# Altium project Audio_Mini.PrjPcb (part 1 of 2)
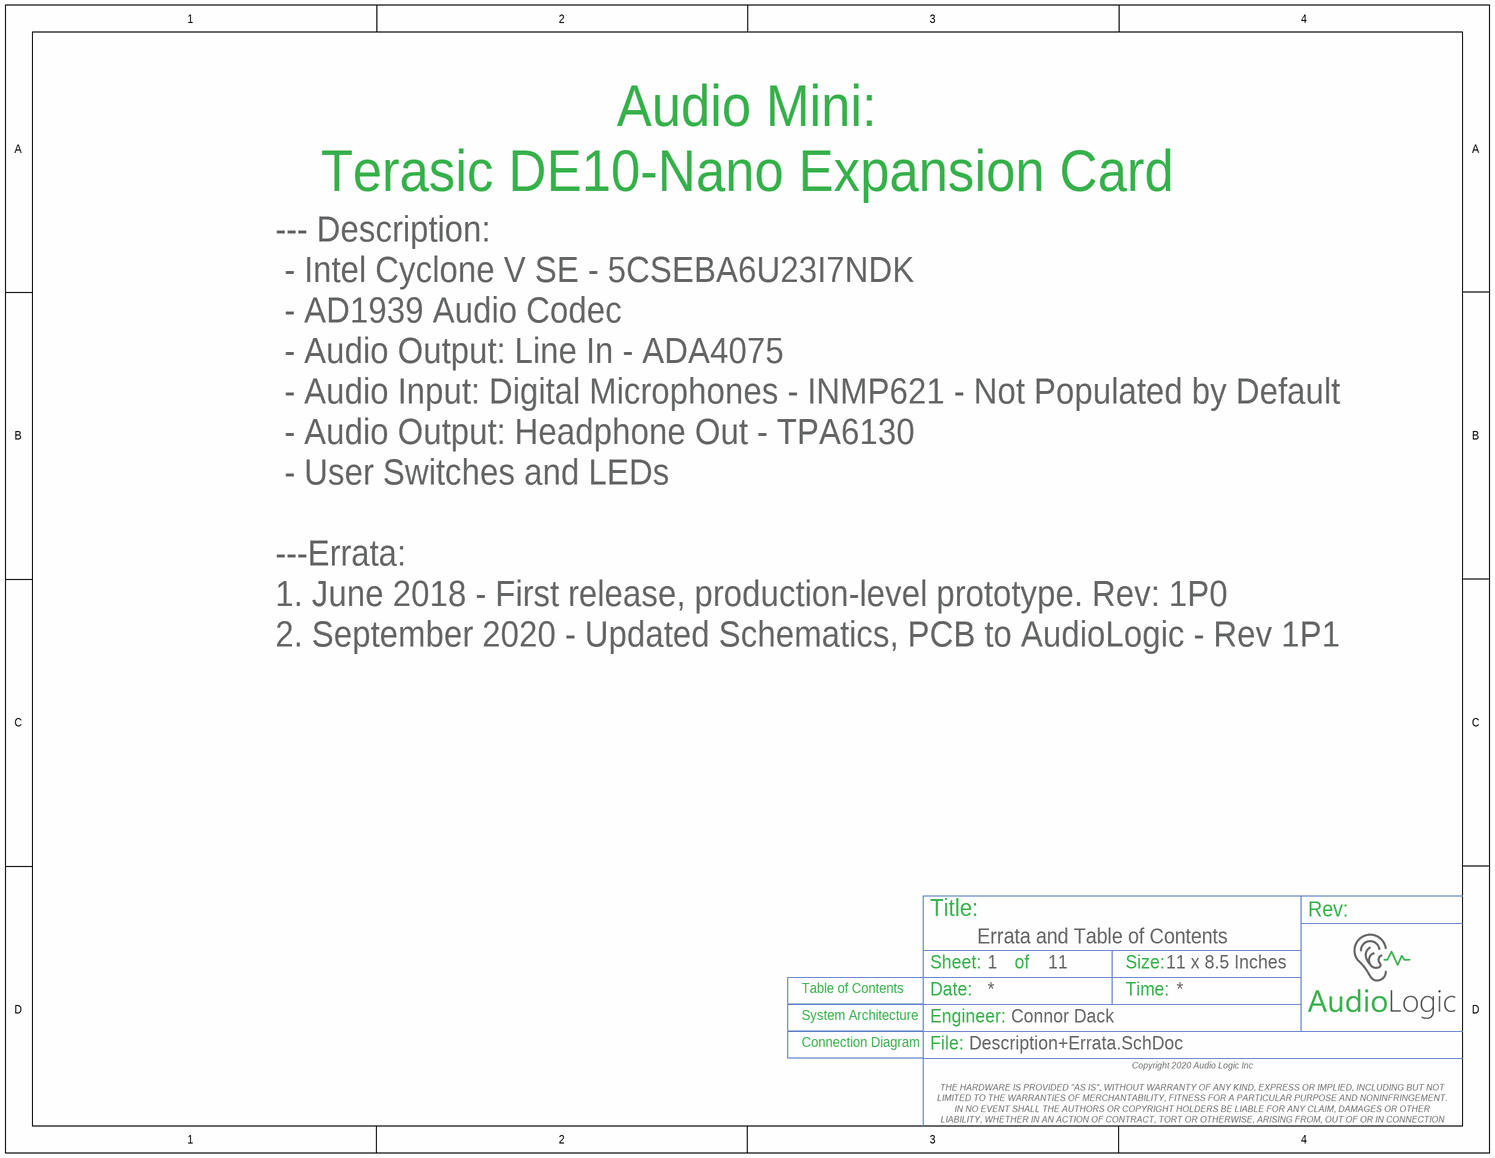
[diagram p0: Description+Errata.SchDoc]
PCB_Name: Audio_Mini_Bare_PCB; PCB_Revision: 1.0
8 sheets, 129 parts. Net scope: flat (ports and power ports of the same name join across sheets).
Board file: Audio_Mini.PcbDoc
Sheets:
  Description+Errata.SchDoc
    System Architecture = System_Architecture.SchDoc
  Audio_Codec.SchDoc
  FPGA_Connectors.SchDoc
  Power.SchDoc
  Support.SchDoc
  Audio_Input_Line_In.SchDoc
  Audio_Output_Headphone.SchDoc

## Sheet Description+Errata.SchDoc: Errata and Table of Contents
size 279 x 215 mm; DrawnBy: Connor Dack; Engineer: Connor Dack; DocumentNumber: 1; Revision: 1.0; SheetNumber: 1; SheetTotal: 11

### Sub-sheets
Connection Diagram = TopLevel.SchDoc (file not in this document): no entries
System Architecture = System_Architecture.SchDoc: no entries
Table of Contents = ToC.SchDoc (file not in this document): no entries

### Notes on the sheet
- Audio Mini:
  Terasic DE10-Nano Expansion Card
- --- Description:
  - Intel Cyclone V SE - 5CSEBA6U23I7NDK
  - AD1939 Audio Codec
  - Audio Output: Line In - ADA4075
  - Audio Input: Digital Microphones - INMP621 - Not Populated by Default
  - Audio Output: Headphone Out - TPA6130
  - User Switches and LEDs
  ---Errata:
  1. June 2018 - First release, production-level prototype. Rev: 1P0
  2. September 2020 - Updated Schematics, PCB to AudioLogic - Rev 1P1
- Title:
- Sheet:
- of
- Size:
- 11 x 8.5 Inches
- Rev:
- Date:
- Engineer:
- Time:
- File:
- Copyright 2020 Audio Logic Inc
  THE HARDWARE IS PROVIDED "AS IS", WITHOUT WARRANTY OF ANY KIND, EXPRESS OR IMPLIED, INCLUDING BUT NOT LIMITED TO THE WARRANTIES OF MERCHANTABILITY, FITNESS FOR A PARTICULAR PURPOSE AND NONINFRINGEMENT. IN NO EVENT SHALL THE AUTHORS OR COPYRIGHT HOLDERS BE LIABLE FOR ANY CLAIM, DAMAGES OR OTHER LIABILITY, WHETHER IN AN ACTION OF CONTRACT, TORT OR OTHERWISE, ARISING FROM, OUT OF OR IN CONNECTION WITH THE HARDWARE OR THE USE OR OTHER DEALINGS IN THE HARDWARE.

## Sheet System_Architecture.SchDoc: System Architecture
size 279 x 215 mm; CompanyName: Flat Earth Inc.; DrawnBy: Connor Dack; Engineer: Connor Dack; Address1: 985 Technology Blvd; Address2: Suite 102; Address3: Bozeman, MT, 59718; DocumentNumber: 3; Revision: 0.0; SheetNumber: 3; SheetTotal: 11
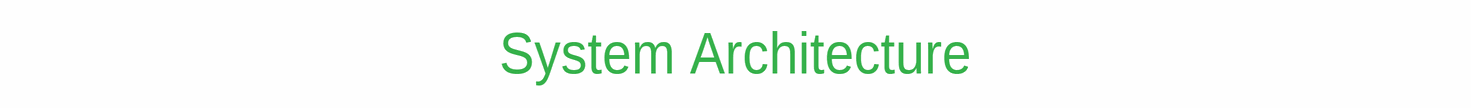
[diagram p1: System_Architecture.SchDoc]

### Notes on the sheet
- System Architecture
- Title:
- Sheet:
- of
- Size:
- 11 x 8.5 Inches
- Rev:
- Date:
- Engineer:
- Time:
- File:
- Copyright 2020 Audio Logic Inc
  THE HARDWARE IS PROVIDED "AS IS", WITHOUT WARRANTY OF ANY KIND, EXPRESS OR IMPLIED, INCLUDING BUT NOT LIMITED TO THE WARRANTIES OF MERCHANTABILITY, FITNESS FOR A PARTICULAR PURPOSE AND NONINFRINGEMENT. IN NO EVENT SHALL THE AUTHORS OR COPYRIGHT HOLDERS BE LIABLE FOR ANY CLAIM, DAMAGES OR OTHER LIABILITY, WHETHER IN AN ACTION OF CONTRACT, TORT OR OTHERWISE, ARISING FROM, OUT OF OR IN CONNECTION WITH THE HARDWARE OR THE USE OR OTHER DEALINGS IN THE HARDWARE.

## Sheet Audio_Codec.SchDoc: Audio Codec
size 279 x 215 mm; DrawnBy: Connor Dack; Engineer: Connor Dack; DocumentNumber: 5; Revision: 1.0; SheetNumber: 5; SheetTotal: 11
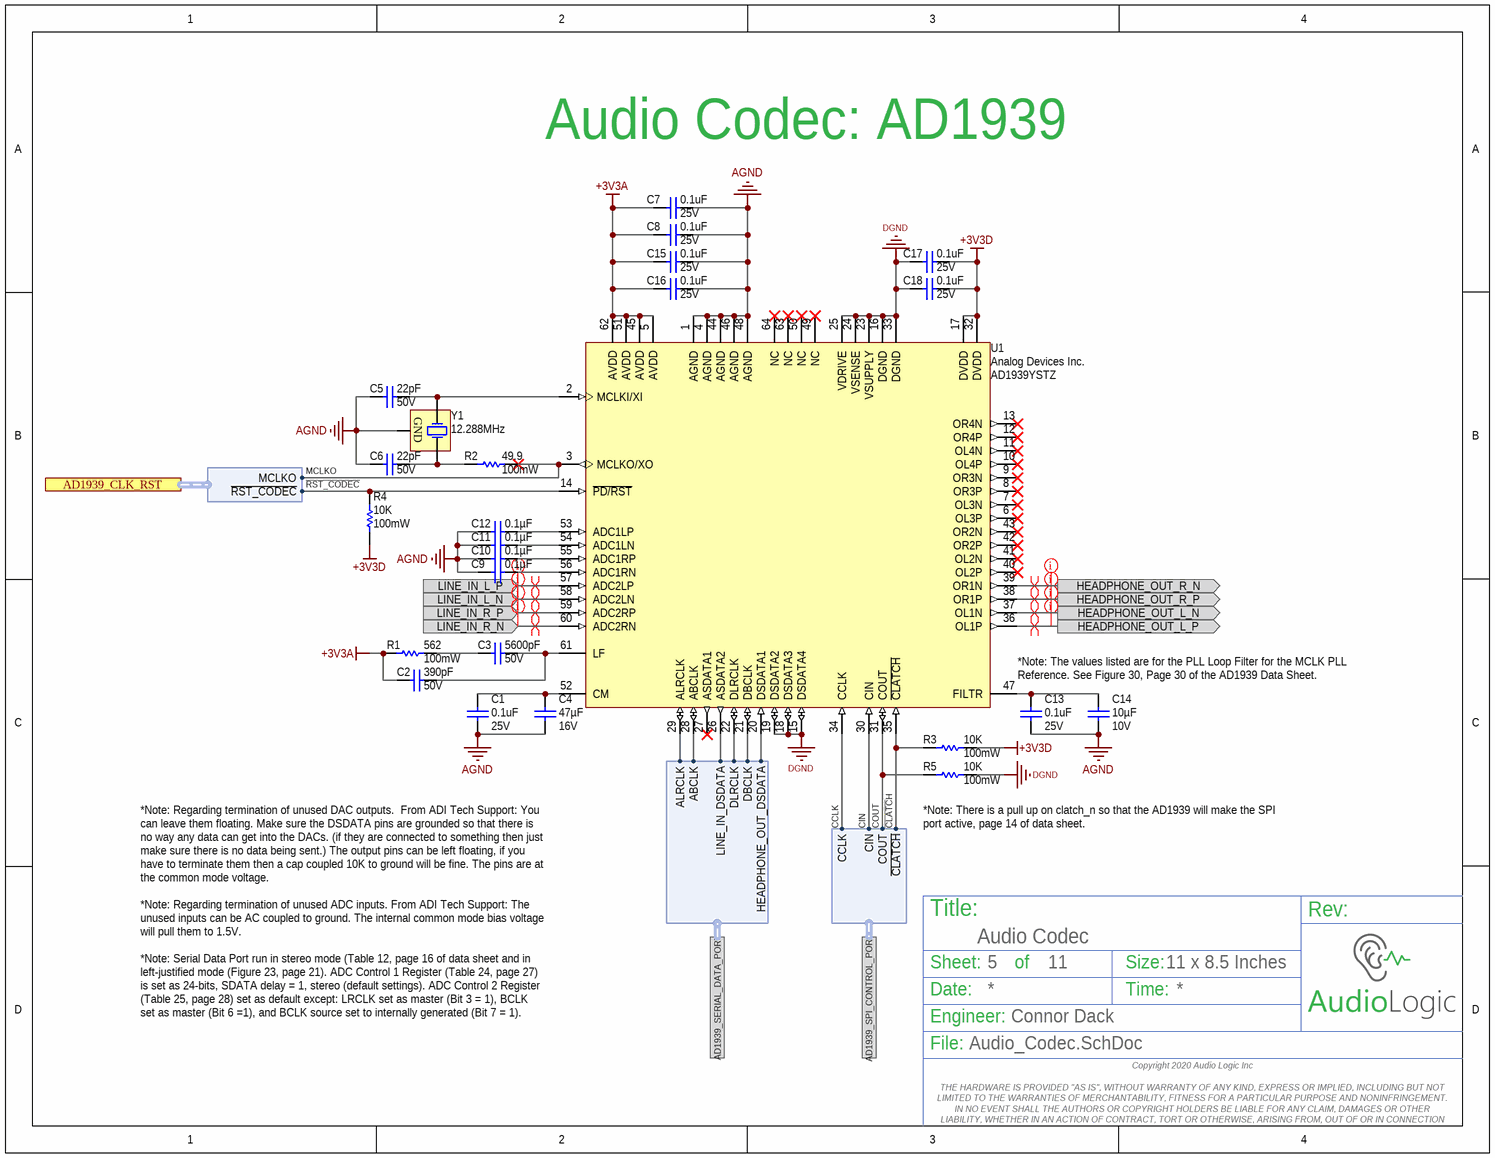
[diagram p2: Audio_Codec.SchDoc]

### Parts
C1  Voltage Rating: 25V  Capacitance: 0.1uF  [3-0603_L]  (hidden comment: CGA3E2X7R1E104K080AA)
C2  Voltage - Rated: 50V  Capacitance: 390pF  [3-0603_L]  (hidden comment: CL10B391KB8NNNC)
C3  Voltage - Rated: 50V  Capacitance: 5600pF  [3-0603_L]  (hidden comment: CL10B562KB8SFNC)
C4  Voltage - Rated: 16V  Capacitance: 47µF  [C1210X25_L]  (hidden comment: GRM32EC81C476KE15L)
C5  Voltage Rating: 50V  Capacitance: 22pF  [3-0603_L]  (hidden comment: CGA3E2C0G1H220J080AA)
C6  Voltage Rating: 50V  Capacitance: 22pF  [3-0603_L]  (hidden comment: CGA3E2C0G1H220J080AA)
C7  Voltage Rating: 25V  Capacitance: 0.1uF  [3-0603_L]  (hidden comment: CGA3E2X7R1E104K080AA)
C8  Voltage Rating: 25V  Capacitance: 0.1uF  [3-0603_L]  (hidden comment: CGA3E2X7R1E104K080AA)
C9  Capacitance: 0.1µF  [2-0402_L]  (hidden comment: CGA2B3X7R1H104K050BB)
C10  Capacitance: 0.1µF  [2-0402_L]  (hidden comment: CGA2B3X7R1H104K050BB)
C11  Capacitance: 0.1µF  [2-0402_L]  (hidden comment: CGA2B3X7R1H104K050BB)
C12  Capacitance: 0.1µF  [2-0402_L]  (hidden comment: CGA2B3X7R1H104K050BB)
C13  Voltage Rating: 25V  Capacitance: 0.1uF  [3-0603_L]  (hidden comment: CGA3E2X7R1E104K080AA)
C14  Voltage - Rated: 10V  Capacitance: 10µF  [3-0603_L]  (hidden comment: C1608X5R1A106K)
C15  Voltage Rating: 25V  Capacitance: 0.1uF  [3-0603_L]  (hidden comment: CGA3E2X7R1E104K080AA)
C16  Voltage Rating: 25V  Capacitance: 0.1uF  [3-0603_L]  (hidden comment: CGA3E2X7R1E104K080AA)
C17  Voltage Rating: 25V  Capacitance: 0.1uF  [3-0603_L]  (hidden comment: CGA3E2X7R1E104K080AA)
C18  Voltage Rating: 25V  Capacitance: 0.1uF  [3-0603_L]  (hidden comment: CGA3E2X7R1E104K080AA)
R1  Power (Watts): 100mW  Resistance (Ohms): 562  [3-0603_R_L]  (hidden comment: ERJ-3EKF5620V)
R2  Power (Watts): 100mW  Resistance (Ohms): 49.9  [3-0603_R_L]  (hidden comment: ERJ-3EKF49R9V)
R3  Power (Watts): 100mW  Resistance (Ohms): 10K  [3-0603_R_L]  (hidden comment: ERJ-3GEYJ103V)
R4  Power (Watts): 100mW  Resistance (Ohms): 10K  [3-0603_R_L]  (hidden comment: ERJ-3GEYJ103V)
R5  Power (Watts): 100mW  Resistance (Ohms): 10K  [3-0603_R_L]  (hidden comment: ERJ-3GEYJ103V)
U1  AD1939YSTZ  Manufacturer: Analog Devices Inc.  [ST_64_2]
Y1  Frequency: 12.288MHz  [ADM3B]  (hidden comment: ABM3B-12.288MHZ-10-1-U-T)

### Ports
AD1939_CLK_RST (harness AD1939_CLK_RST), AD1939_SERIAL_DATA_PORT (harness AD19319_Serial_Data_Port), AD1939_SPI_CONTROL_PORT (harness SPI_Audio_Codec), HEADPHONE_OUT_L_N (out), HEADPHONE_OUT_L_P (out), HEADPHONE_OUT_R_N (out), HEADPHONE_OUT_R_P (out), LINE_IN_L_N (in), LINE_IN_L_P (in), LINE_IN_R_N (in), LINE_IN_R_P (in)

### Harnesses
SPI_Audio_Codec: CIN, COUT, CCLK, ~{CLATCH}
AD19319_Serial_Data_Port: ABCLK, ALRCLK, LINE_IN_DSDATA, DLRCLK, DBCLK, HEADPHONE_OUT_DSDATA
AD1939_CLK_RST: ~{RST_CODEC}, MCLKO

### Nets
+3V3A: C2.1 C7.1 C8.2 C15.1 C16.1 R1.1 U1.5(AVDD) U1.45(AVDD) U1.51(AVDD) U1.62(AVDD)
+3V3D: C17.2 C18.1 R3.1 R4.1 U1.17(DVDD) U1.32(DVDD)
AGND: C1.1 C4.2 C5.1 C6.1 C7.2 C8.1 C9.2 C10.2 C11.2 C12.2 C13.1 C14.1 C15.2 C16.2 C17.1 C18.2 R5.1 U1.1(AGND) U1.4(AGND) U1.15(DSDATA4) U1.16(DGND) U1.18(DSDATA3) U1.19(DSDATA2) U1.23(VSUPPLY) U1.24(VSENSE) U1.25(VDRIVE) U1.33(DGND) U1.44(AGND) U1.46(AGND) U1.48(AGND) Y1.2(GND)  [also labelled DGND]
~{CLATC}H: R3.2 U1.35(~{CLATCH}) ; port AD1939_SPI_CONTROL_PORT.~{CLATCH}
ABCLK: U1.28(ABCLK) ; port AD1939_SERIAL_DATA_PORT.ABCLK
ALRCLK: U1.29(ALRCLK) ; port AD1939_SERIAL_DATA_PORT.ALRCLK
CCLK: U1.34(CCLK) ; port AD1939_SPI_CONTROL_PORT.CCLK
CIN: U1.30(CIN) ; port AD1939_SPI_CONTROL_PORT.CIN
COUT: R5.2 U1.31(COUT) ; port AD1939_SPI_CONTROL_PORT.COUT
DBCLK: U1.21(DBCLK) ; port AD1939_SERIAL_DATA_PORT.DBCLK
DLRCLK: U1.22(DLRCLK) ; port AD1939_SERIAL_DATA_PORT.DLRCLK
HEADPHONE_OUT_DSDATA: U1.20(DSDATA1) ; port AD1939_SERIAL_DATA_PORT.HEADPHONE_OUT_DSDATA
HEADPHONE_OUT_L_N: U1.37(OL1N) ; port HEADPHONE_OUT_L_N
HEADPHONE_OUT_L_P: U1.36(OL1P) ; port HEADPHONE_OUT_L_P
HEADPHONE_OUT_R_N: U1.39(OR1N) ; port HEADPHONE_OUT_R_N
HEADPHONE_OUT_R_P: U1.38(OR1P) ; port HEADPHONE_OUT_R_P
LINE_IN_DSDATA: U1.26(ASDATA2) ; port AD1939_SERIAL_DATA_PORT.LINE_IN_DSDATA
LINE_IN_L_N: U1.58(ADC2LN) ; port LINE_IN_L_N
LINE_IN_L_P: U1.57(ADC2LP) ; port LINE_IN_L_P
LINE_IN_R_N: U1.60(ADC2RN) ; port LINE_IN_R_N
LINE_IN_R_P: U1.59(ADC2RP) ; port LINE_IN_R_P
MCLKO: R2.2 U1.3(MCLKO/XO) ; port AD1939_CLK_RST.MCLKO
~{RST_CODEC}: R4.2 U1.14(~{PD/RST}) ; port AD1939_CLK_RST.~{RST_CODEC}
NetC1_2: C1.2 C4.1 U1.52(CM)
NetC2_2: C2.2 C3.2 U1.61(LF)
NetC3_1: C3.1 R1.2
NetC5_2: C5.2 U1.2(MCLKI/XI) Y1.1(OSC1)
NetC6_2: C6.2 R2.1 Y1.3(OSC2)
NetC9_1: C9.1 U1.56(ADC1RN)
NetC10_1: C10.1 U1.55(ADC1RP)
NetC11_1: C11.1 U1.54(ADC1LN)
NetC12_1: C12.1 U1.53(ADC1LP)
NetC13_2: C13.2 C14.2 U1.47(FILTR)

Not connected (* = marked no-connect by the designer): U1 6(OL3P)* 7(OL3N)* 8(OR3P)* 9(OR3N)* 10(OL4P)* 11(OL4N)* 12(OR4P)* 13(OR4N)* 27(ASDATA1)* 40(OL2P)* 41(OL2N)* 42(OR2P)* 43(OR2N)* 49(NC)* 50(NC)* 63(NC)* 64(NC)*

### Layout directives
differential pair: HEADPHONE_OUT_L_N, HEADPHONE_OUT_L_P, HEADPHONE_OUT_R_N, HEADPHONE_OUT_R_P, LINE_IN_L_N, LINE_IN_L_P, LINE_IN_R_N, LINE_IN_R_P
net class Headphone: HEADPHONE_OUT_L_N, HEADPHONE_OUT_L_P, HEADPHONE_OUT_R_N, HEADPHONE_OUT_R_P
net class LINE_IN: LINE_IN_L_N, LINE_IN_L_P, LINE_IN_R_N, LINE_IN_R_P

### Notes on the sheet
- Audio Codec: AD1939
- *Note: The values listed are for the PLL Loop Filter for the MCLK PLL Reference. See Figure 30, Page 30 of the AD1939 Data Sheet.
- (near R5) *Note: There is a pull up on clatch_n so that the AD1939 will make the SPI port active, page 14 of data sheet.
- *Note: Regarding termination of unused DAC outputs.  From ADI Tech Support: You can leave them floating. Make sure the DSDATA pins are grounded so that there is no way any data can get into the DACs. (if they are connected to something then just make sure there is no data being sent.) The output pins can be left floating, if you have to terminate them then a cap coupled 10K to ground will be fine. The pins are at the common mode voltage.
  *Note: Regarding termination of unused ADC inputs. From ADI Tech Support: The unused inputs can be AC coupled to ground. The internal common mode bias voltage will pull them to 1.5V.
  *Note: Serial Data Port run in stereo mode (Table 12, page 16 of data sheet and in left-justified mode (Figure 23, page 21). ADC Control 1 Register (Table 24, page 27) is set as 24-bits, SDATA delay = 1, stereo (default settings). ADC Control 2 Register (Table 25, page 28) set as default except: LRCLK set as master (Bit 3 = 1), BCLK set as master (Bit 6 =1), and BCLK source set to internally generated (Bit 7 = 1).
- Title:
- Sheet:
- of
- Size:
- 11 x 8.5 Inches
- Rev:
- Date:
- Engineer:
- Time:
- File:
- Copyright 2020 Audio Logic Inc
  THE HARDWARE IS PROVIDED "AS IS", WITHOUT WARRANTY OF ANY KIND, EXPRESS OR IMPLIED, INCLUDING BUT NOT LIMITED TO THE WARRANTIES OF MERCHANTABILITY, FITNESS FOR A PARTICULAR PURPOSE AND NONINFRINGEMENT. IN NO EVENT SHALL THE AUTHORS OR COPYRIGHT HOLDERS BE LIABLE FOR ANY CLAIM, DAMAGES OR OTHER LIABILITY, WHETHER IN AN ACTION OF CONTRACT, TORT OR OTHERWISE, ARISING FROM, OUT OF OR IN CONNECTION WITH THE HARDWARE OR THE USE OR OTHER DEALINGS IN THE HARDWARE.

### Library data of the parts
C1 C7 C8 C13 C15-C18 = CGA3E2X7R1E104K080AA: CAP CER 0.1UF 25V X7R 0603; Manufacturer: TDK; Tolerance: 10%; ComponentLink1URL: https://datasheet.ciiva.com/24218/cga3e2x7r1h332k080aa-266003-24218741.pdf; ComponentLink1Description: https://datasheet.ciiva.com/24218/cga3e2x7r1h332k080aa-266003-24218741.pdf; Supplier 1: Digi-Key; Manufacturer Part Number: CGA3E2X7R1E104K080AA; Stock 1: 170098; Pricing 1: 1=0.1, 10=0.063, 100=0.0279, 500=0.0199, 1000=0.0156 (USD); Mount: Surface Mount; Case/Package: 0603; Weight: 7.1E-05oz; Case Code (Metric): 1608; Case Code (Imperial): 0603; Min Operating Temperature: -55°C; Max Operating Temperature: 125°C; Packaging: Tape and Reel; Package Quantity: 1; Voltage Rating (DC): 25V; Dielectric: X7R; Termination: SMD/SMT; Composition: Ceramic; Length: 1.6mm; Height: 0.8mm; Width: 0.031inch; Thickness: 0.035inch; Depth: 0.8mm; REACH SVHC: No SVHC; Lead Free: Lead Free; ComponentLink2URL: https://datasheet.ciiva.com/22725/1735392-22725638.pdf; ComponentLink2Description: https://datasheet.ciiva.com/22725/1735392-22725638.pdf; ComponentLink3URL: https://datasheet.ciiva.com/24220/cga3e2x7r1e104k080aa-265934-24220022.pdf; ComponentLink3Description: https://datasheet.ciiva.com/24220/cga3e2x7r1e104k080aa-265934-24220022.pdf; ComponentLink4URL: https://datasheet.ciiva.com/22725/1735392-22725639.pdf; ComponentLink4Description: https://datasheet.ciiva.com/22725/1735392-22725639.pdf; ComponentLink5URL: https://datasheet.ciiva.com/16427/mlccspec-automotive-general-midvoltage-en-16427320.pdf; ComponentLink5Description: https://datasheet.ciiva.com/16427/mlccspec-automotive-general-midvoltage-en-16427320.pdf; ComponentLink6URL: https://datasheet.ciiva.com/23803/1735392-23803082.pdf; ComponentLink6Description: https://datasheet.ciiva.com/23803/1735392-23803082.pdf; Supplier Part Number 1: 445-5667-6-ND
C2 = CL10B391KB8NNNC: 390pF 50V Ceramic Capacitor X7R 0603 (1608 Metric) 0.063" L x 0.031" W (1.60mm x 0.80mm); Manufacturer: Samsung Electro-Mechanics America, Inc.; Tolerance: ±10%; Supplier 1: Digi-Key; Manufacturer Part Number: CL10B391KB8NNNC; RoHS: RoHS Compliant; Category: Capacitors; Stock 1: 10890; Pricing 1: 1=0.1, 10=0.035, 25=0.0248, 50=0.0192, 100=0.0162, 500=0.01132, 1000=0.00882 (USD); Packaging: Cut Tape (CT); Part Status: Active; Temperature Coefficient: X7R; Mounting Type: Surface Mount, MLCC; Operating Temperature: -55°C ~ 125°C; Applications: General Purpose; Ratings: -; Package / Case: 0603 (1608 Metric); Size / Dimension: 0.063" L x 0.031" W (1.60mm x 0.80mm); Height - Seated (Max): -; Thickness (Max): 0.035" (0.90mm); Lead Spacing: -; Features: -; Lead Style: -; ComponentLink1URL: http://www.samsungsem.com/kr/support/product-search/mlcc/__icsFiles/afieldfile/2016/08/18/S_CL10B391KB8NNNC.pdf; ComponentLink1Description: http://www.samsungsem.com/kr/support/product-search/mlcc/__icsFiles/afieldfile/2016/08/18/S_CL10B391KB8NNNC.pdf; Supplier Part Number 1: 1276-2049-1-ND; Load Status: *
C3 = CL10B562KB8SFNC: 5600pF 50V Ceramic Capacitor X7R 0603 (1608 Metric) 0.063" L x 0.031" W (1.60mm x 0.80mm); Manufacturer: Samsung Electro-Mechanics America, Inc.; Tolerance: ±10%; Supplier 1: Digi-Key; Manufacturer Part Number: CL10B562KB8SFNC; RoHS: RoHS Compliant; Category: Capacitors; Stock 1: 35381; Pricing 1: 1=0.1, 10=0.048, 25=0.034, 50=0.0262, 100=0.0221, 500=0.01548, 1000=0.01206 (USD); Packaging: Cut Tape (CT); Part Status: Active; Temperature Coefficient: X7R; Mounting Type: Surface Mount, MLCC; Operating Temperature: -55°C ~ 125°C; Applications: Boardflex Sensitive; Ratings: -; Package / Case: 0603 (1608 Metric); Size / Dimension: 0.063" L x 0.031" W (1.60mm x 0.80mm); Height - Seated (Max): -; Thickness (Max): 0.035" (0.90mm); Lead Spacing: -; Features: Soft Termination; Lead Style: -; ComponentLink1URL: http://www.samsungsem.com/kr/support/product-search/mlcc/__icsFiles/afieldfile/2016/08/18/S_CL10B562KB8SFNC.pdf; ComponentLink1Description: http://www.samsungsem.com/kr/support/product-search/mlcc/__icsFiles/afieldfile/2016/08/18/S_CL10B562KB8SFNC.pdf; Supplier Part Number 1: 1276-2092-1-ND; Load Status: *
C4 = GRM32EC81C476KE15L: 47µF ±10% 16V Ceramic Capacitor X6S 1210 (3225 Metric); Manufacturer: Murata Electronics North America; Supplier 1: Digi-Key; Manufacturer Part Number: GRM32EC81C476KE15L; RoHS: RoHS Compliant; Category: Capacitors; Stock 1: 39641; Pricing 1: 1=0.73, 10=0.697, 25=0.4944, 50=0.4164, 100=0.3383, 250=0.28108, 500=0.25504 (USD); Packaging: Cut Tape (CT); Tolerance: ±10%; Temperature Coefficient: X6S; Mounting Type: Surface Mount, MLCC; Operating Temperature: -55°C ~ 105°C; Applications: General Purpose; Ratings: -; Package / Case: 1210 (3225 Metric); Size / Dimension: 0.126" L x 0.098" W (3.20mm x 2.50mm); Height - Seated (Max): -; Thickness (Max): 0.106" (2.70mm); Lead Spacing: -; Features: Derating Recommended; Lead Style: -; ComponentLink1URL: http://www.murata.com/~/media/webrenewal/support/library/catalog/products/capacitor/mlcc/c02e.pdf; ComponentLink1Description: http://www.murata.com/~/media/webrenewal/support/library/catalog/products/capacitor/mlcc/c02e.pdf; Supplier Part Number 1: 490-10531-1-ND; Part Status: Active; Failure Rate: *; Load Status: *
C5 C6 = CGA3E2C0G1H220J080AA: CAP CER 22PF 50V C0G 0603; Manufacturer: TDK; Tolerance: 5%; ComponentLink1URL: https://datasheet.ciiva.com/24217/cga3e2c0g1h220j080aa-265896-24217329.pdf; ComponentLink1Description: https://datasheet.ciiva.com/24217/cga3e2c0g1h220j080aa-265896-24217329.pdf; Supplier 1: Digi-Key; Manufacturer Part Number: CGA3E2C0G1H220J080AA; Stock 1: 26658; Pricing 1: 1=0.1, 10=0.063, 100=0.0279, 500=0.0199, 1000=0.0156 (USD); Mount: Surface Mount; Case/Package: 0603; Weight: 7.1E-05oz; Case Code (Imperial): 0603; Case Code (Metric): 1608; Min Operating Temperature: -55°C; Max Operating Temperature: 125°C; Voltage Rating (DC): 50V; Packaging: Tape and Reel; Package Quantity: 1; Dielectric: C0G; Termination: SMD/SMT; Composition: Ceramic; Length: 1.6mm; Height: 0.8mm; Width: 0.8mm; Thickness: 0.035inch; Depth: 0.8mm; REACH SVHC: No SVHC; Lead Free: Lead Free; Supplier Part Number 1: 445-5632-6-ND
C9-C12 = CGA2B3X7R1H104K050BB: CAP CER 0.1UF 50V X7R 0402; Manufacturer: TDK Corporation; Tolerance: ±10%; Supplier 1: Digi-Key; Manufacturer Part Number: CGA2B3X7R1H104K050BB; RoHS: RoHS Compliant; Category: Capacitors; Stock 1: 1156628; Pricing 1: 1=0.16, 10=0.11, 100=0.0523, 250=0.044, 500=0.03686, 1000=0.03025, 5000=0.02558 (USD); Packaging: Cut Tape (CT); Part Status: Active; Voltage - Rated: 50V; Temperature Coefficient: X7R; Operating Temperature: -55°C ~ 125°C; Features: -; Ratings: AEC-Q200; Applications: Automotive; Failure Rate: -; Mounting Type: Surface Mount, MLCC; Package / Case: 0402 (1005 Metric); Size / Dimension: 0.039" L x 0.020" W (1.00mm x 0.50mm); Height - Seated (Max): -; Thickness (Max): 0.022" (0.55mm); Lead Spacing: -; Lead Style: -; ComponentLink1URL: https://product.tdk.com/info/en/catalog/datasheets/mlcc_automotive_general_en.pdf; ComponentLink1Description: https://product.tdk.com/info/en/catalog/datasheets/mlcc_automotive_general_en.pdf; Supplier Part Number 1: 445-6899-1-ND
C14 = C1608X5R1A106K: CAP CER 10UF 10V 10% X5R 0603; Manufacturer: TDK Corporation; Supplier 1: Digi-Key; Manufacturer Part Number: C1608X5R1A106K; RoHS: RoHS Compliant; Category: Capacitors; Stock 1: 36523; Pricing 1: 1=0.48, 10=0.42, 100=0.21, 250=0.168, 500=0.153, 1000=0.138 (USD); Tolerance: ±10%; Temperature Coefficient: X5R; Mounting Type: Surface Mount, MLCC; Operating Temperature: -55°C ~ 85°C; Applications: General Purpose; Ratings: -; Package / Case: 0603 (1608 Metric); Size / Dimension: 0.063" L x 0.031" W (1.60mm x 0.80mm); Height - Seated (Max): -; Thickness (Max): 0.035" (0.90mm); Lead Spacing: -; Features: -; Packaging: Cut Tape (CT); Lead Style: -; ComponentLink1URL: http://www.tdk.com/pdf/general_B11.pdf; ComponentLink1Description: http://www.tdk.com/pdf/general_B11.pdf; Supplier Part Number 1: 445-7486-1-ND; Load Status: *
R1 = ERJ-3EKF5620V: RES SMD 562 OHM 1% 1/10W 0603; Manufacturer: Panasonic Electronic Components; Temperature Coefficient: ±100ppm/°C; Supplier 1: Digi-Key; Manufacturer Part Number: ERJ-3EKF5620V; RoHS: RoHS Compliant; Category: Resistors; Stock 1: 336376; Pricing 1: 1=0.1, 50=0.0114, 100=0.0084, 250=0.00644, 500=0.00514, 1000=0.00379 (USD); Packaging: Cut Tape (CT); Part Status: Active; Tolerance: ±1%; Composition: Thick Film; Features: Automotive AEC-Q200; Operating Temperature: -55°C ~ 155°C; Package / Case: 0603 (1608 Metric); Supplier Device Package: 0603; Size / Dimension: 0.063" L x 0.031" W (1.60mm x 0.80mm); Height: 0.022" (0.55mm); Number of Terminations: 2; Failure Rate: -; ComponentLink1URL: http://industrial.panasonic.com/www-cgi/jvcr13pz.cgi?E+PZ+3+AOA0002+ERJ3EKF5620V+7+WW; ComponentLink1Description: http://industrial.panasonic.com/www-cgi/jvcr13pz.cgi?E+PZ+3+AOA0002+ERJ3EKF5620V+7+WW; Supplier Part Number 1: P562HCT-ND; Load Status: *
R2 = ERJ-3EKF49R9V: RES SMD 49.9 OHM 1% 1/10W 0603; Manufacturer: Panasonic Electronic Components; Temperature Coefficient: ±100ppm/°C; Supplier 1: Digi-Key; RoHS: RoHS Compliant; Category: Resistors; Stock 1: 1715606; Pricing 1: 1=0.1, 10=0.019, 25=0.0136, 50=0.0104, 100=0.0077, 250=0.00584, 500=0.00468, 1000=0.00345 (USD); Packaging: Cut Tape (CT); Part Status: Active; Tolerance: ±1%; Composition: Thick Film; Features: Automotive AEC-Q200; Operating Temperature: -55°C ~ 155°C; Package / Case: 0603 (1608 Metric); Supplier Device Package: 0603; Size / Dimension: 0.063" L x 0.031" W (1.60mm x 0.80mm); Height - Seated (Max): 0.022" (0.55mm); Number of Terminations: 2; Failure Rate: -; ComponentLink1URL: http://industrial.panasonic.com/www-cgi/jvcr13pz.cgi?E+PZ+3+AOA0002+ERJ3EKF49R9V+7+WW; ComponentLink1Description: http://industrial.panasonic.com/www-cgi/jvcr13pz.cgi?E+PZ+3+AOA0002+ERJ3EKF49R9V+7+WW; Supplier Part Number 1: P49.9HCT-ND; Load Status: *
R3-R5 = ERJ-3GEYJ103V: RES 10K OHM 1/10W 5% 0603 SMD; Manufacturer: Panasonic - ECG; Temperature Coefficient: ±200ppm/°C; Supplier 1: Digi-Key; Manufacturer Part Number: ERJ-3GEYJ103V; RoHS: RoHS Compliant; Category: Resistors; Stock 1: 16219504; Pricing 1: 1=0.02, 50=0.0092, 100=0.007, 250=0.0052, 500=0.00384, 1000=0.00256 (USD); Composition: Thick Film; Features: -; Tolerance: ±5%; Package / Case: 0603 (1608 Metric); Size / Dimension: 0.063" L x 0.031" W (1.60mm x 0.80mm); Height: 0.022" (0.55mm); Number of Terminations: 2; Packaging: Cut Tape (CT); ComponentLink1URL: http://industrial.panasonic.com/www-cgi/jvcr13pz.cgi?E+PZ+3+AOA0001+ERJ3GEYJ103V+7+WW; ComponentLink1Description: http://industrial.panasonic.com/www-cgi/jvcr13pz.cgi?E+PZ+3+AOA0001+ERJ3GEYJ103V+7+WW; Supplier Part Number 1: P10KGCT-ND; Load Status: *
U1 = AD1939YSTZ: Single-chip codec that prvides 4 ADCs with differential input and 8 DACs with differential output; Data Interface: Serial; Resolution (Bits): 24 b; Number of ADCs / DACs: 4 / 8; Sigma Delta: Yes; S/N Ratio, ADCs / DACs (db) Typ: 94 / 94; Dynamic Range, ADCs / DACs (db) Typ: 105 / 110; Voltage - Supply, Analog: 3 V ~ 3.6 V; Supplier 1: Digi-Key; RoHS: RoHS Compliant; Category: Integrated Circuits (ICs); Stock 1: 432; Pricing 1: 1=15.81, 10=14.527, 100=12.269, 500=10.91416, 1000=10.01091, 2500=9.63456, 5000=9.33348 (USD); Packaging: Tray; Type: General Purpose; Voltage - Supply, Digital: 3 V ~ 3.6 V; Operating Temperature: -40°C ~ 105°C; Mounting Type: Surface Mount; Package / Case: 64-LQFP; Supplier Device Package: 64-LQFP (10x10); ComponentLink1URL: http://www.analog.com/media/en/technical-documentation/data-sheets/AD1939.pdf; ComponentLink1Description: http://www.analog.com/media/en/technical-documentation/data-sheets/AD1939.pdf; Supplier Part Number 1: AD1939YSTZ-ND; Manufacturer Part Number: AD1939YSTZ
Y1 = XTAL_12.288MHz: 12.288MHz ±10ppm Crystal 10pF 70 Ohm -10°C ~ 60°C Surface Mount 4-SMD, No Lead (DFN, LCC); Manufacturer: Abracon LLC; ESR (Equivalent Series Resistance): 70 Ohm; Operating Mode: Fundamental; Supplier 1: Digi-Key; RoHS: RoHS Compliant; Category: Crystals and Oscillators; Stock 1: 1220; Pricing 1: 1=1.09, 10=0.968, 50=0.904, 100=0.8, 500=0.756 (USD); Packaging: Cut Tape (CT); Part Status: Active; Type: MHz Crystal; Frequency Stability: ±10ppm; Frequency Tolerance: ±10ppm; Load Capacitance: 10pF; Operating Temperature: -10°C ~ 60°C; Ratings: -; Mounting Type: Surface Mount; Package / Case: 4-SMD, No Lead (DFN, LCC); Size / Dimension: 0.197" L x 0.126" W (5.00mm x 3.20mm); Height: 0.043" (1.10mm); ComponentLink1URL: http://www.abracon.com/Resonators/abm3b.pdf; ComponentLink1Description: http://www.abracon.com/Resonators/abm3b.pdf; Supplier Part Number 1: 300-8198-1-ND; Manufacturer Part Number: ABM3B-12.288MHZ-10-1-U-T

## Sheet FPGA_Connectors.SchDoc: FPGA Connectors
size 279 x 215 mm; DrawnBy: Connor Dack; Engineer: Connor Dack; DocumentNumber: 6; Revision: 1.0; SheetNumber: 6; SheetTotal: 11
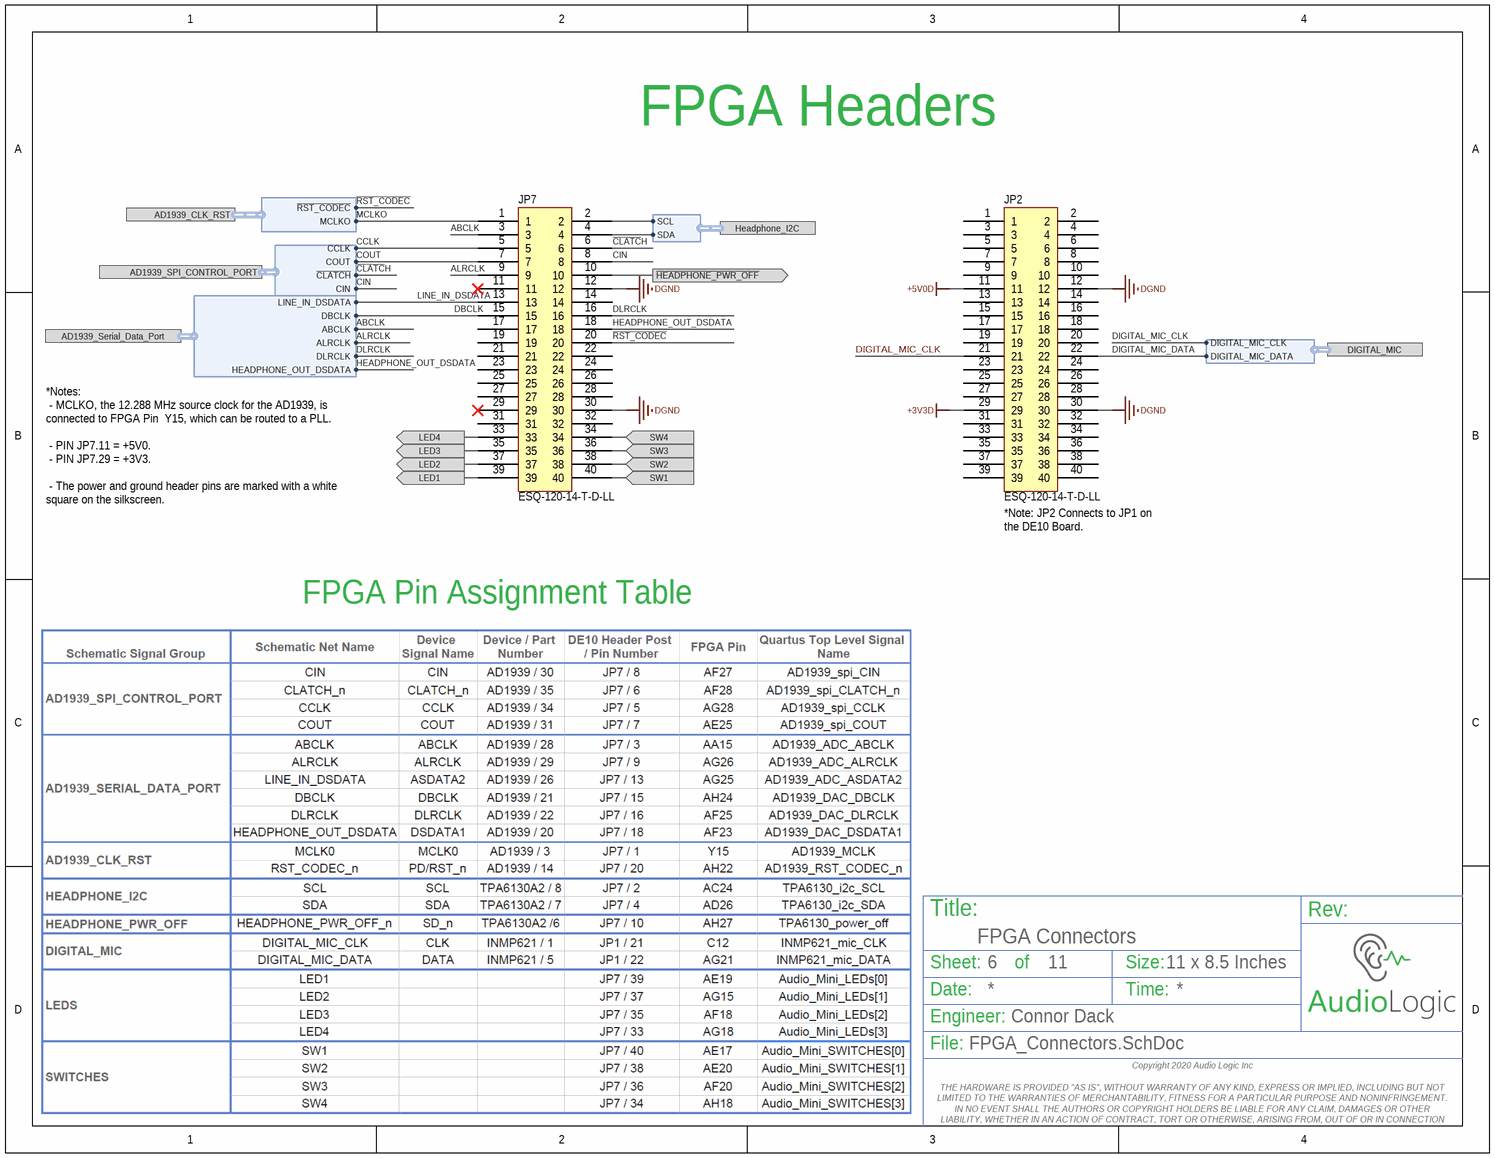
[diagram p3: FPGA_Connectors.SchDoc]

### Parts
JP2  ESQ-120-14-T-D-LL  [ESQ-120-24-T-D-LL]
JP7  ESQ-120-14-T-D-LL  [ESQ-120-24-T-D-LL]

### Ports
AD1939_CLK_RST (harness AD1939_CLK_RST), AD1939_Serial_Data_Port (harness AD19319_Serial_Data_Port), AD1939_SPI_CONTROL_PORT (harness SPI_Audio_Codec), DIGITAL_MIC (harness Digital_Mic), Headphone_I2C (harness I2C_Headphone), LED1 (out), LED2 (out), LED3 (out), LED4 (out), SW1 (in), SW2 (in), SW3 (in), SW4 (in), ~{HEADPHONE_PWR_OFF} (out)

### Harnesses
I2C_Headphone: SDA, SCL
SPI_Audio_Codec: CIN, COUT, CCLK, ~{CLATCH}
AD19319_Serial_Data_Port: ABCLK, ALRCLK, LINE_IN_DSDATA, DLRCLK, DBCLK, HEADPHONE_OUT_DSDATA
Digital_Mic: DIGITAL_MIC_CLK, DIGITAL_MIC_DATA
AD1939_CLK_RST: ~{RST_CODEC}, MCLKO

### Nets
+3V3D: JP2.29
+5V0D: JP2.11
DGND: JP2.12 JP2.30 JP7.12 JP7.30  [project net AGND]
~{CLATC}H: JP7.6 ; port AD1939_SPI_CONTROL_PORT.~{CLATCH}
ABCLK: JP7.3 ; port AD1939_Serial_Data_Port.ABCLK
ALRCLK: JP7.9 ; port AD1939_Serial_Data_Port.ALRCLK
CCLK: JP7.5 ; port AD1939_SPI_CONTROL_PORT.CCLK
CIN: JP7.8 ; port AD1939_SPI_CONTROL_PORT.CIN
COUT: JP7.7 ; port AD1939_SPI_CONTROL_PORT.COUT
DBCLK: JP7.15 ; port AD1939_Serial_Data_Port.DBCLK
DIGITAL_MIC_CLK: JP2.21 ; port DIGITAL_MIC.DIGITAL_MIC_CLK
DIGITAL_MIC_DATA: JP2.22 ; port DIGITAL_MIC.DIGITAL_MIC_DATA
DLRCLK: JP7.16 ; port AD1939_Serial_Data_Port.DLRCLK
~{HEADPHONE_PWR_OFF}: JP7.10 ; port ~{HEADPHONE_PWR_OFF}
HEADPHONE_OUT_DSDATA: JP7.18 ; port AD1939_Serial_Data_Port.HEADPHONE_OUT_DSDATA
LED1: JP7.39 ; port LED1
LED2: JP7.37 ; port LED2
LED3: JP7.35 ; port LED3
LED4: JP7.33 ; port LED4
LINE_IN_DSDATA: JP7.13 ; port AD1939_Serial_Data_Port.LINE_IN_DSDATA
MCLKO: JP7.1 ; port AD1939_CLK_RST.MCLKO
~{RST_CODEC}: JP7.20 ; port AD1939_CLK_RST.~{RST_CODEC}
SW1: JP7.40 ; port SW1
SW2: JP7.38 ; port SW2
SW3: JP7.36 ; port SW3
SW4: JP7.34 ; port SW4
NetJP7_2: JP7.2 ; port Headphone_I2C.SCL
NetJP7_4: JP7.4 ; port Headphone_I2C.SDA

Not connected (* = marked no-connect by the designer): JP2 1 2 3 4 5 6 7 8 9 10 13 14 15 16 17 18 19 20 23 24 25 26 27 28 31 32 33 34 35 36 37 38 39 40; JP7 11* 14 17 19 21 22 23 24 25 26 27 28 29* 31 32

### Notes on the sheet
- FPGA Headers
- *Notes:
  - MCLKO, the 12.288 MHz source clock for the AD1939, is connected to FPGA Pin  Y15, which can be routed to a PLL.
  - PIN JP7.11 = +5V0.
  - PIN JP7.29 = +3V3.
  - The power and ground header pins are marked with a white square on the silkscreen.
- (near JP2) *Note: JP2 Connects to JP1 on the DE10 Board.
- FPGA Pin Assignment Table
- Title:
- Sheet:
- of
- Size:
- 11 x 8.5 Inches
- Rev:
- Date:
- Engineer:
- Time:
- File:
- Copyright 2020 Audio Logic Inc
  THE HARDWARE IS PROVIDED "AS IS", WITHOUT WARRANTY OF ANY KIND, EXPRESS OR IMPLIED, INCLUDING BUT NOT LIMITED TO THE WARRANTIES OF MERCHANTABILITY, FITNESS FOR A PARTICULAR PURPOSE AND NONINFRINGEMENT. IN NO EVENT SHALL THE AUTHORS OR COPYRIGHT HOLDERS BE LIABLE FOR ANY CLAIM, DAMAGES OR OTHER LIABILITY, WHETHER IN AN ACTION OF CONTRACT, TORT OR OTHERWISE, ARISING FROM, OUT OF OR IN CONNECTION WITH THE HARDWARE OR THE USE OR OTHER DEALINGS IN THE HARDWARE.

### Library data of the parts
JP2 JP7 = CON_TH_0D100P_2x20: Female to Male 0D100P 2x20 Connector; Manufacturer: Samtec; LatestRevisionDate: 17-Jul-2002; LatestRevisionNote: Re-released for DXP Platform.; Publisher: Altium Limited; Manufacturer Part Number: ESQ-120-14-T-D-LL; Supplier 1: Samtec; Supplier Part Number 1: ESQ-120-14-T-D-LL; Load Status: *

## Sheet Power.SchDoc: Power Regulation
size 279 x 215 mm; DrawnBy: Connor Dack; Engineer: Connor Dack; DocumentNumber: 7; Revision: 1.0; SheetNumber: 7; SheetTotal: 11
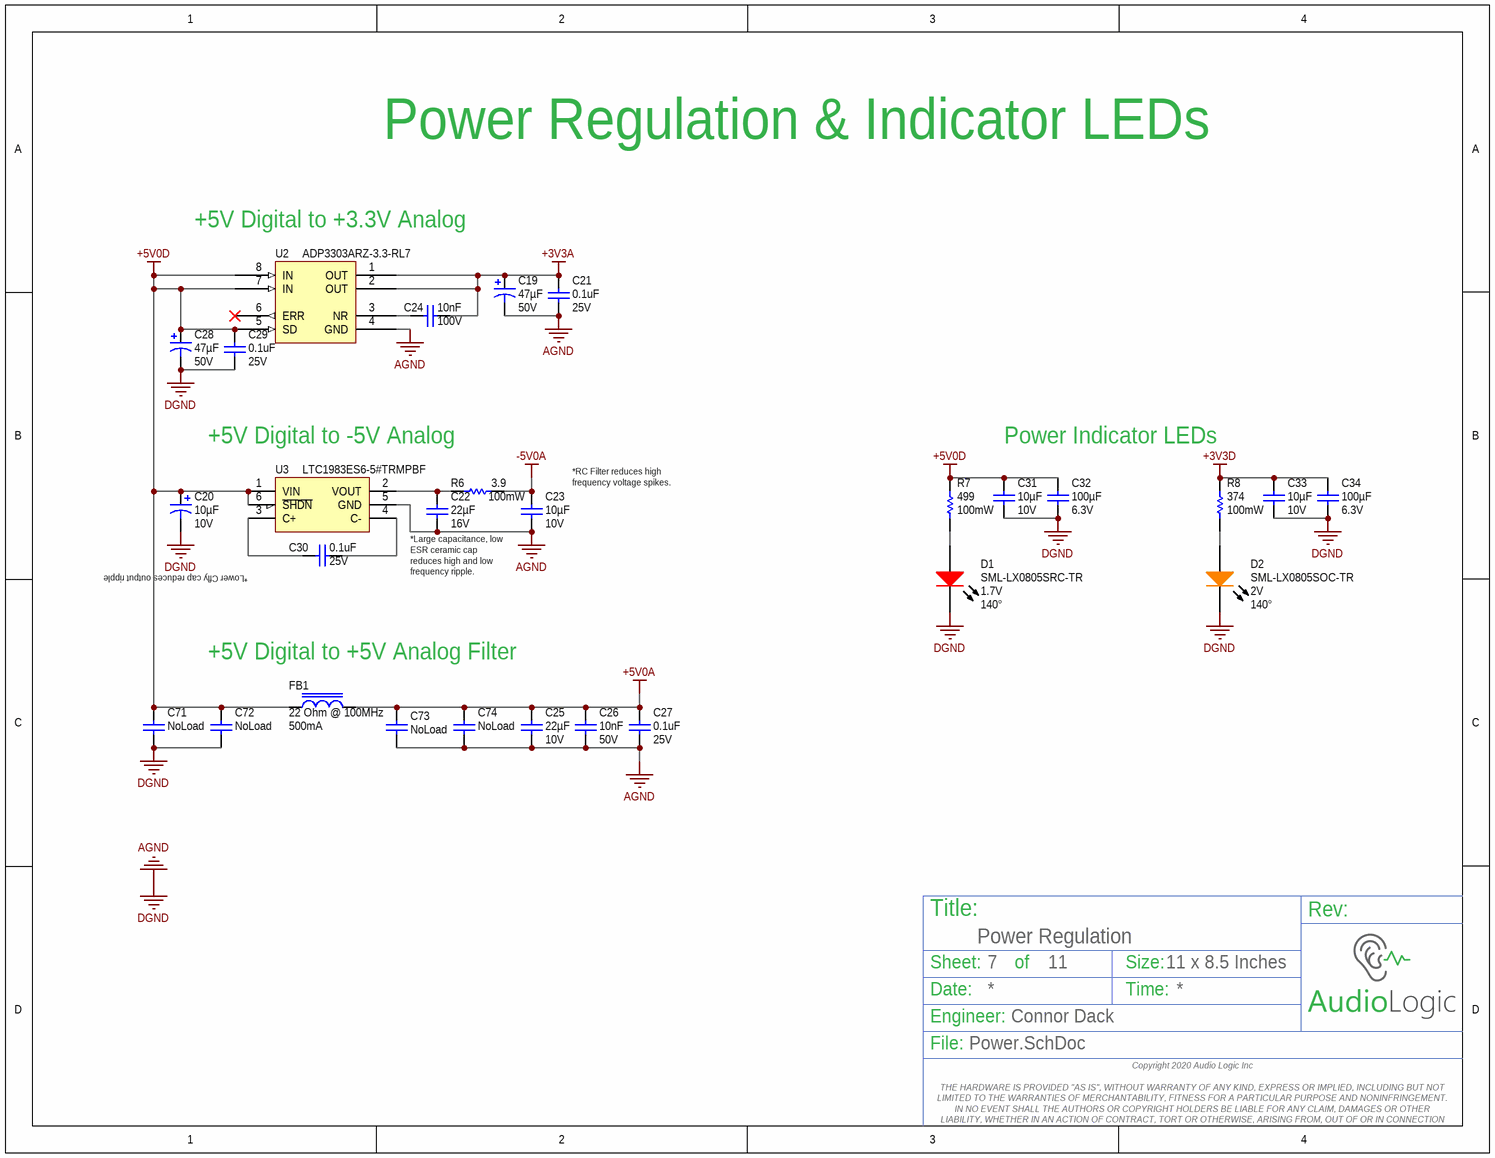
[diagram p4: Power.SchDoc]

### Parts
C19  Voltage Rating: 50V  Capacitance: 47µF  [ALUMCAPC630D_D]  (hidden comment: EEE-FT1H470AP)
C20  Voltage - Rated: 10V  Capacitance: 10µF  [C1206_TANT]  (hidden comment: TPSA106K010R0900)
C21  Voltage Rating: 25V  Capacitance: 0.1uF  [3-0603_L]  (hidden comment: CGA3E2X7R1E104K080AA)
C22  Voltage - Rated: 16V  Capacitance: 22µF  [C1206]  (hidden comment: C3216X6S1C226M)
C23  Voltage - Rated: 10V  Capacitance: 10µF  [3-0603_L]  (hidden comment: C1608X5R1A106K)
C24  Voltage - Rated: 100V  Capacitance: 10nF  [3-0603_L]  (hidden comment: C1608X7R2A103K080AA)
C25  Voltage - Rated: 10V  Capacitance: 22µF  [6-0805_L]  (hidden comment: CL21A226KPCLRNC)
C26  Voltage - Rated: 50V  Capacitance: 10nF  [3-0603_L]  (hidden comment: C0603C103J5RACTU)
C27  Voltage Rating: 25V  Capacitance: 0.1uF  [3-0603_L]  (hidden comment: CGA3E2X7R1E104K080AA)
C28  Voltage Rating: 50V  Capacitance: 47µF  [ALUMCAPC630D_D]  (hidden comment: EEE-FT1H470AP)
C29  Voltage Rating: 25V  Capacitance: 0.1uF  [3-0603_L]  (hidden comment: CGA3E2X7R1E104K080AA)
C30  Voltage Rating: 25V  Capacitance: 0.1uF  [3-0603_L]  (hidden comment: CGA3E2X7R1E104K080AA)
C31  Voltage - Rated: 10V  Capacitance: 10µF  [3-0603_L]  (hidden comment: C1608X5R1A106K)
C32  Voltage - Rated: 6.3V  Capacitance: 100µF  [C1210X25_L]  (hidden comment: CL32X107MQVNNNE)
C33  Voltage - Rated: 10V  Capacitance: 10µF  [3-0603_L]  (hidden comment: C1608X5R1A106K)
C34  Voltage - Rated: 6.3V  Capacitance: 100µF  [C1210X25_L]  (hidden comment: CL32X107MQVNNNE)
C71  Capacitance: NoLoad  [3-0603_L_DNP]  (hidden comment: CAP 0603)
C72  Capacitance: NoLoad  [3-0603_L_DNP]  (hidden comment: CAP 0603)
C73  Capacitance: NoLoad  [3-0603_L_DNP]  (hidden comment: CAP 0603)
C74  Capacitance: NoLoad  [3-0603_L_DNP]  (hidden comment: CAP 0603)
D1  Voltage - Forward (Vf) (Typ): 1.7V  Viewing Angle: 140°  [DIOM2012X12L_RED]  (hidden comment: SML-LX0805SRC-TR)
D2  Voltage - Forward (Vf) (Typ): 2V  Viewing Angle: 140°  [DIOM2012X12L_ORANGE]  (hidden comment: SML-LX0805SOC-TR)
FB1  Current Rating: 500mA  Impedance @ Frequency: 22 Ohm @ 100MHz  [3-0603_L]  (hidden comment: BLM18BA220SN1D)
R6  Power (Watts): 100mW  Resistance (Ohms): 3.9  [3-0603_R_L]  (hidden comment: ERJ-3RQF3R9V)
R7  Power (Watts): 100mW  Resistance (Ohms): 499  [3-0603_R_L]  (hidden comment: ERJ-3EKF4990V)
R8  Power (Watts): 100mW  Resistance (Ohms): 374  [3-0603_R_L]  (hidden comment: ERJ-3EKF3740V)
U2  ADP3303ARZ-3.3-RL7  [SOIC127P600X175-8N]
U3  LTC1983ES6-5#TRMPBF  [SOT23-6_L]

### Nets
+3V3A: C19.1(P) C21.1 C24.1 U2.1(OUT) U2.2(OUT)
+3V3D: C33.2 C34.2 R8.2
+5V0A: C25.2 C26.2 C27.1 C73.2 C74.2 FB1.2
+5V0D: C20.1(P) C28.1(P) C29.1 C31.2 C32.2 C71.2 C72.2 FB1.1 R7.2 U2.5(SD) U2.7(IN) U2.8(IN) U3.1(VIN) U3.6(~{SHDN})
-5V0A: C23.2 R6.2
AGND: C19.2(N) C20.2(N) C21.2 C22.1 C23.1 C25.1 C26.1 C27.2 C28.2(N) C29.2 C31.1 C32.1 C33.1 C34.1 C71.1 C72.1 C73.1 C74.1 D1.2(K) D2.2(K) U2.4(GND) U3.5(GND)  [also labelled DGND]
NetC22_2: C22.2 R6.1 U3.2(VOUT)
NetC24_2: C24.2 U2.3(NR)
NetC30_1: C30.1 U3.4(C-)
NetC30_2: C30.2 U3.3(C+)
NetD1_1: D1.1(A) R7.1
NetD2_1: D2.1(A) R8.1

Not connected (* = marked no-connect by the designer): U2 6(ERR)*

### Notes on the sheet
- Power Regulation & Indicator LEDs
- +5V Digital to +3.3V Analog
- +5V Digital to -5V Analog
- (near C23) *RC Filter reduces high frequency voltage spikes.
- Power Indicator LEDs
- (near C30) *Lower Cfly cap reduces output ripple
- (near C22) *Large capacitance, low ESR ceramic cap reduces high and low frequency ripple.
- +5V Digital to +5V Analog Filter
- Title:
- Sheet:
- of
- Size:
- 11 x 8.5 Inches
- Rev:
- Date:
- Engineer:
- Time:
- File:
- Copyright 2020 Audio Logic Inc
  THE HARDWARE IS PROVIDED "AS IS", WITHOUT WARRANTY OF ANY KIND, EXPRESS OR IMPLIED, INCLUDING BUT NOT LIMITED TO THE WARRANTIES OF MERCHANTABILITY, FITNESS FOR A PARTICULAR PURPOSE AND NONINFRINGEMENT. IN NO EVENT SHALL THE AUTHORS OR COPYRIGHT HOLDERS BE LIABLE FOR ANY CLAIM, DAMAGES OR OTHER LIABILITY, WHETHER IN AN ACTION OF CONTRACT, TORT OR OTHERWISE, ARISING FROM, OUT OF OR IN CONNECTION WITH THE HARDWARE OR THE USE OR OTHER DEALINGS IN THE HARDWARE.

### Library data of the parts
C19 C28 = EEE-FT1H470AP: CAP ALUM 47UF 50V 20% SMD; Manufacturer: Panasonic - ECG; Lifetime @ Temp.: 2000 Hrs @ 105°C; Ripple Current: 195mA; ESR (Equivalent Series Resistance): 680.0 mOhm; Surface Mount Land Size: 0.260" L x 0.260" W (6.60mm x 6.60mm); Supplier 1: Digi-Key; Manufacturer Part Number: EEE-FT1H470AP; RoHS: RoHS Compliant; Category: Capacitors; Stock 1: 1772; Pricing 1: 1=0.81, 50=0.4834, 100=0.4229, 250=0.33232, 500=0.3021 (USD); Tolerance: ±20%; Operating Temperature: -55°C ~ 105°C; Features: General Purpose; Impedance: -; Mounting Type: Surface Mount; Package / Case: Radial, Can - SMD; Size / Dimension: 0.248" Dia (6.30mm); Height - Seated (Max): 0.240" (6.10mm); Lead Spacing: -; Packaging: Cut Tape (CT); ComponentLink1URL: http://industrial.panasonic.com/www-cgi/jvcr17pz.cgi?E+PZ+4+ABA0134+0+WW; ComponentLink1Description: http://industrial.panasonic.com/www-cgi/jvcr17pz.cgi?E+PZ+4+ABA0134+0+WW; Supplier Part Number 1: PCE5023CT-ND; Load Status: *
C20 = TPSA106K010R0900: CAP TANT 10UF 10V 10% 1206; Manufacturer: AVX Corporation; Manufacturer Size Code: A; ESR (Equivalent Series Resistance): 900 mOhm; Type: Molded; Supplier 1: Digi-Key; Manufacturer Part Number: TPSA106K010R0900; RoHS: RoHS Compliant; Category: Capacitors; Stock 1: 62197; Pricing 1: 1=0.77, 10=0.737, 100=0.3575, 250=0.297, 500=0.2695, 1000=0.2475 (USD); Packaging: Cut Tape (CT); Tolerance: ±10%; Operating Temperature: -55°C ~ 125°C; Mounting Type: Surface Mount; Package / Case: 1206 (3216 Metric); Size / Dimension: 0.126" L x 0.063" W (3.20mm x 1.60mm); Height - Seated (Max): 0.071" (1.80mm); Lead Spacing: -; Features: General Purpose; Lifetime @ Temp.: -; ComponentLink1URL: http://www.avx.com/docs/Catalogs/tps.pdf; ComponentLink1Description: http://www.avx.com/docs/Catalogs/tps.pdf; Supplier Part Number 1: 478-1751-1-ND; Load Status: *
C21 C27 C29 C30 = CGA3E2X7R1E104K080AA: as C1 on sheet Audio_Codec; ComponentLink1URL: https://datasheet.ciiva.com/24218/cga3e2x7r1h332k080aa-266003-24218741.pdf; ComponentLink1Description: https://datasheet.ciiva.com/24218/cga3e2x7r1h332k080aa-266003-24218741.pdf; Supplier 1: Digi-Key; Manufacturer Part Number: CGA3E2X7R1E104K080AA; Stock 1: 170098; Pricing 1: 1=0.1, 10=0.063, 100=0.0279, 500=0.0199, 1000=0.0156 (USD); Mount: Surface Mount; Case/Package: 0603; Weight: 7.1E-05oz; Case Code (Metric): 1608; Case Code (Imperial): 0603; Min Operating Temperature: -55°C; Max Operating Temperature: 125°C; Packaging: Tape and Reel; Package Quantity: 1; Voltage Rating (DC): 25V; Dielectric: X7R; Termination: SMD/SMT; Composition: Ceramic; Length: 1.6mm; Height: 0.8mm; Width: 0.031inch; Thickness: 0.035inch; Depth: 0.8mm; REACH SVHC: No SVHC; Lead Free: Lead Free; ComponentLink2URL: https://datasheet.ciiva.com/22725/1735392-22725638.pdf; ComponentLink2Description: https://datasheet.ciiva.com/22725/1735392-22725638.pdf; ComponentLink3URL: https://datasheet.ciiva.com/24220/cga3e2x7r1e104k080aa-265934-24220022.pdf; ComponentLink3Description: https://datasheet.ciiva.com/24220/cga3e2x7r1e104k080aa-265934-24220022.pdf; ComponentLink4URL: https://datasheet.ciiva.com/22725/1735392-22725639.pdf; ComponentLink4Description: https://datasheet.ciiva.com/22725/1735392-22725639.pdf; ComponentLink5URL: https://datasheet.ciiva.com/16427/mlccspec-automotive-general-midvoltage-en-16427320.pdf; ComponentLink5Description: https://datasheet.ciiva.com/16427/mlccspec-automotive-general-midvoltage-en-16427320.pdf; ComponentLink6URL: https://datasheet.ciiva.com/23803/1735392-23803082.pdf; ComponentLink6Description: https://datasheet.ciiva.com/23803/1735392-23803082.pdf; Supplier Part Number 1: 445-5667-6-ND
C22 = C3216X6S1C226M: CAP CER 22UF 16V 20% X6S 1206; Manufacturer: TDK Corporation; Supplier 1: Digi-Key; Manufacturer Part Number: C3216X6S1C226M; RoHS: RoHS Compliant; Category: Capacitors; Stock 1: 4138; Pricing 1: 1=1.13, 10=0.94, 100=0.6, 250=0.5, 500=0.45, 1000=0.41 (USD); Tolerance: ±20%; Temperature Coefficient: X6S; Mounting Type: Surface Mount, MLCC; Operating Temperature: -55°C ~ 105°C; Applications: General Purpose; Ratings: -; Package / Case: 1206 (3216 Metric); Size / Dimension: 0.126" L x 0.063" W (3.20mm x 1.60mm); Height - Seated (Max): -; Thickness (Max): -; Lead Spacing: -; Features: -; Packaging: Cut Tape (CT); Lead Style: -; ComponentLink1URL: http://www.tdk.com/pdf/general_B11.pdf; ComponentLink1Description: http://www.tdk.com/pdf/general_B11.pdf; Supplier Part Number 1: 445-8044-1-ND; Load Status: *
C23 C31 C33 = C1608X5R1A106K: as C14 on sheet Audio_Codec; Supplier 1: Digi-Key; Manufacturer Part Number: C1608X5R1A106K; RoHS: RoHS Compliant; Category: Capacitors; Stock 1: 36523; Pricing 1: 1=0.48, 10=0.42, 100=0.21, 250=0.168, 500=0.153, 1000=0.138 (USD); Tolerance: ±10%; Temperature Coefficient: X5R; Mounting Type: Surface Mount, MLCC; Operating Temperature: -55°C ~ 85°C; Applications: General Purpose; Ratings: -; Package / Case: 0603 (1608 Metric); Size / Dimension: 0.063" L x 0.031" W (1.60mm x 0.80mm); Height - Seated (Max): -; Thickness (Max): 0.035" (0.90mm); Lead Spacing: -; Features: -; Packaging: Cut Tape (CT); Lead Style: -; ComponentLink1URL: http://www.tdk.com/pdf/general_B11.pdf; ComponentLink1Description: http://www.tdk.com/pdf/general_B11.pdf; Supplier Part Number 1: 445-7486-1-ND; Load Status: *
C24 = C1608X7R2A103K080AA: CAP CER 10000PF 100V X7R 0603; Manufacturer: TDK Corporation; Tolerance: ±10%; Supplier 1: Digi-Key; Manufacturer Part Number: C1608X7R2A103K080AA; RoHS: RoHS Compliant; Category: Capacitors; Stock 1: 257721; Pricing 1: 1=0.1, 10=0.06, 100=0.0275, 250=0.02252, 500=0.01926, 1000=0.015 (USD); Packaging: Cut Tape (CT); Temperature Coefficient: X7R; Mounting Type: Surface Mount, MLCC; Operating Temperature: -55°C ~ 125°C; Applications: General Purpose; Ratings: -; Package / Case: 0603 (1608 Metric); Size / Dimension: 0.063" L x 0.031" W (1.60mm x 0.80mm); Height - Seated (Max): -; Thickness (Max): 0.037" (0.95mm); Lead Spacing: -; Features: -; Lead Style: -; ComponentLink1URL: http://product.tdk.com/capacitor/mlcc/en/documents/mlcc_commercial_midvoltage_en.pdf; ComponentLink1Description: http://product.tdk.com/capacitor/mlcc/en/documents/mlcc_commercial_midvoltage_en.pdf; Supplier Part Number 1: 445-1304-1-ND; Load Status: *
C25 = CL21A226KPCLRNC: CAP CER 22UF 10V X5R 0805; Manufacturer: Samsung Electro-Mechanics America, Inc.; Tolerance: ±10%; Supplier 1: Digi-Key; Manufacturer Part Number: CL21A226KPCLRNC; RoHS: RoHS Compliant; Category: Capacitors; Stock 1: 70317; Pricing 1: 1=0.25, 10=0.173, 25=0.1384, 50=0.1154, 100=0.0981, 250=0.07788, 500=0.06924, 1000=0.06059 (USD); Packaging: Cut Tape (CT); Part Status: Active; Temperature Coefficient: X5R; Operating Temperature: -55°C ~ 85°C; Features: Low Profile; Ratings: -; Applications: General Purpose; Failure Rate: *; Mounting Type: Surface Mount, MLCC; Package / Case: 0805 (2012 Metric); Size / Dimension: 0.079" L x 0.049" W (2.00mm x 1.25mm); Height - Seated (Max): -; Thickness (Max): 0.037" (0.95mm); Lead Spacing: -; Lead Style: -; ComponentLink1URL: http://www.samsungsem.com/kr/support/product-search/mlcc/__icsFiles/afieldfile/2016/08/18/S_CL21A226KPCLRNC.pdf; ComponentLink1Description: http://www.samsungsem.com/kr/support/product-search/mlcc/__icsFiles/afieldfile/2016/08/18/S_CL21A226KPCLRNC.pdf; Supplier Part Number 1: 1276-6786-1-ND; Load Status: *
C26 = C0603C103J5RACTU: CAP CER 10000PF 50V 5% X7R 0603; Manufacturer: Kemet; Supplier 1: Digi-Key; Manufacturer Part Number: C0603C103J5RACTU; RoHS: RoHS Compliant; Category: Capacitors; Stock 1: 187680; Pricing 1: 1=0.1, 10=0.036, 50=0.0196, 100=0.0165, 250=0.01352, 500=0.01156, 1000=0.009 (USD); Tolerance: ±5%; Temperature Coefficient: X7R; Mounting Type: Surface Mount, MLCC; Operating Temperature: -55°C ~ 125°C; Applications: General Purpose; Ratings: -; Package / Case: 0603 (1608 Metric); Size / Dimension: 0.063" L x 0.031" W (1.60mm x 0.80mm); Height - Seated (Max): -; Thickness (Max): 0.034" (0.87mm); Lead Spacing: -; Features: -; Packaging: Cut Tape (CT); Lead Style: -; ComponentLink1URL: http://www.kemet.com/datasheets&C0603C103J5RACTU; ComponentLink1Description: http://www.kemet.com/datasheets&C0603C103J5RACTU; Supplier Part Number 1: 399-1092-1-ND; Load Status: *
C32 C34 = CL32X107MQVNNNE: 100µF 6.3V Ceramic Capacitor X6S 1210 (3225 Metric) 0.126" L x 0.098" W (3.20mm x 2.50mm); Manufacturer: Samsung Electro-Mechanics America, Inc.; Tolerance: ±20%; Supplier 1: Digi-Key; Manufacturer Part Number: CL32X107MQVNNNE; RoHS: RoHS Compliant; Category: Capacitors; Stock 1: 19666; Pricing 1: 1=1.35, 10=1.13, 25=0.974, 50=0.914, 100=0.7215, 500=0.54112 (USD); Packaging: Cut Tape (CT); Part Status: Active; Temperature Coefficient: X6S; Mounting Type: Surface Mount, MLCC; Operating Temperature: -55°C ~ 105°C; Applications: General Purpose; Ratings: -; Package / Case: 1210 (3225 Metric); Size / Dimension: 0.126" L x 0.098" W (3.20mm x 2.50mm); Height - Seated (Max): -; Thickness (Max): 0.110" (2.80mm); Lead Spacing: -; Features: -; Lead Style: -; ComponentLink1URL: http://www.samsungsem.com/kr/front/downloadcms.do?path=/kr/support/product-search/mlcc/__icsFiles/afieldfile/2014/11/05&fileName=C_CL32X107MQVNNNE.pdf; ComponentLink1Description: http://www.samsungsem.com/kr/front/downloadcms.do?path=/kr/support/product-search/mlcc/__icsFiles/afieldfile/2014/11/05&fileName=C_CL32X107MQVNNNE.pdf; Supplier Part Number 1: 1276-3399-1-ND; Load Status: *
C71-C74 = CAP 0603: CAP 0603 SMD - NoLoad; Load Status: Do Not Install
D1 = LED_RED 4: LED 660NM SUPER RED CLR 0805 T/R; Manufacturer: Lumex Opto/Components Inc; Millicandela Rating: 25mcd; Current - Test: 20mA; Lens Type: Clear; Supplier 1: Digi-Key; RoHS: RoHS Compliant; Category: Optoelectronics; Stock 1: 1141; Pricing 1: 1=0.56, 10=0.395, 100=0.2596, 250=0.19472, 500=0.177, 1000=0.1416 (USD); Packaging: Cut Tape (CT); Color: Red; Wavelength - Dominant: -; Wavelength - Peak: 660nm; Lens Style/Size: *; Package / Case: 0805 (2012 Metric); Size / Dimension: 2.00mm L x 1.25mm W; Height: 1.10mm; Mounting Type: Surface Mount; Luminous Flux @ Current - Test: -; ComponentLink1URL: http://www.lumex.com/specs/SML-LX0805SRC-TR.pdf; ComponentLink1Description: http://www.lumex.com/specs/SML-LX0805SRC-TR.pdf; Supplier Part Number 1: 67-2191-1-ND; Manufacturer Part Number: SML-LX0805SRC-TR; Load Status: *
D2 = LED_ORANGE 3: LED 610NM SUPER ORANGE 0805 SMD; Manufacturer: Lumex Opto/Components Inc; Millicandela Rating: 60mcd; Current - Test: 20mA; Lens Type: Clear; Lens Style/Size: Rectangle with Flat Top, 1.4mm x 1.25mm; Supplier 1: Digi-Key; RoHS: RoHS Compliant; Category: Optoelectronics; Stock 1: 13373; Pricing 1: 1=0.65, 10=0.502, 100=0.3255, 250=0.279, 500=0.2418, 1000=0.186 (USD); Packaging: Cut Tape (CT); Color: Orange; Wavelength - Dominant: -; Wavelength - Peak: 610nm; Package / Case: 0805 (2012 Metric); Size / Dimension: 2.00mm L x 1.25mm W; Height: 1.10mm; Mounting Type: Surface Mount; Luminous Flux @ Current - Test: -; ComponentLink1URL: http://www.lumex.com/specs/SML-LX0805SOC-TR.pdf; ComponentLink1Description: http://www.lumex.com/specs/SML-LX0805SOC-TR.pdf; Supplier Part Number 1: 67-1637-1-ND; Manufacturer Part Number: SML-LX0805SOC-TR; Load Status: *
FB1 = BLM18BA220SN1D: FERRITE CHIP 22 OHM 500MA 0603; Manufacturer: Murata Electronics North America; DC Resistance (DCR): 350 mOhm Max; Filter Type: Differential Mode - Single; Supplier 1: Digi-Key; Manufacturer Part Number: BLM18BA220SN1D; RoHS: RoHS Compliant; Category: Filters; Stock 1: 10969; Pricing 1: 1=0.24, 10=0.18, 50=0.105, 100=0.084, 250=0.06, 500=0.0408, 1000=0.033 (USD); Package / Case: 0603 (1608 Metric); Mounting Type: Surface Mount; Packaging: Cut Tape (CT); Height (Max): 0.037" (0.95mm); Size / Dimension: 0.063" L x 0.031" W (1.60mm x 0.80mm); ComponentLink1URL: http://search.murata.co.jp/Ceramy/image/img/PDF/ENG/L0110S0100BLM18B.pdf; ComponentLink1Description: http://search.murata.co.jp/Ceramy/image/img/PDF/ENG/L0110S0100BLM18B.pdf; Supplier Part Number 1: 490-1016-1-ND; Load Status: *
R6 = ERJ-3RQF3R9V: RES 3.9 OHM 1/10W 1% 0603 SMD; Manufacturer: Panasonic Electronic Components; Temperature Coefficient: ±200ppm/°C; Supplier 1: Digi-Key; Manufacturer Part Number: ERJ-3RQF3R9V; RoHS: RoHS Compliant; Category: Resistors; Stock 1: 44573; Pricing 1: 1=0.29, 50=0.1138, 100=0.0878, 250=0.06824, 500=0.0481, 1000=0.0351 (USD); Packaging: Cut Tape (CT); Tolerance: ±1%; Composition: Thick Film; Features: -; Package / Case: 0603 (1608 Metric); Supplier Device Package: 0603; Size / Dimension: 0.063" L x 0.031" W (1.60mm x 0.80mm); Height: 0.022" (0.55mm); Number of Terminations: 2; ComponentLink1URL: http://industrial.panasonic.com/www-cgi/jvcr13pz.cgi?E+PZ+3+AOA0003+ERJ3RQF3R9V+7+WW; ComponentLink1Description: http://industrial.panasonic.com/www-cgi/jvcr13pz.cgi?E+PZ+3+AOA0003+ERJ3RQF3R9V+7+WW; Supplier Part Number 1: P3.9AJCT-ND; Load Status: *
R7 = ERJ-3EKF4990V: RES 499 OHM 1/10W 1% 0603 SMD; Manufacturer: Panasonic - ECG; Temperature Coefficient: ±100ppm/°C; Supplier 1: Digi-Key; Manufacturer Part Number: ERJ-3EKF4990V; RoHS: RoHS Compliant; Category: Resistors; Stock 1: 748630; Pricing 1: 1=0.1, 50=0.0138, 100=0.0105, 250=0.0078, 500=0.00576, 1000=0.00384 (USD); Composition: Thick Film; Features: -; Tolerance: ±1%; Package / Case: 0603 (1608 Metric); Size / Dimension: 0.063" L x 0.031" W (1.60mm x 0.80mm); Height: 0.022" (0.55mm); Number of Terminations: 2; Packaging: Cut Tape (CT); ComponentLink1URL: http://industrial.panasonic.com/www-cgi/jvcr13pz.cgi?E+PZ+3+AOA0002+ERJ3EKF4990V+7+WW; ComponentLink1Description: http://industrial.panasonic.com/www-cgi/jvcr13pz.cgi?E+PZ+3+AOA0002+ERJ3EKF4990V+7+WW; Supplier Part Number 1: P499HCT-ND; Load Status: *
R8 = ERJ-3EKF3740V: RES SMD 374 OHM 1% 1/10W 0603; Manufacturer: Panasonic Electronic Components; Temperature Coefficient: ±100ppm/°C; Supplier 1: Digi-Key; Manufacturer Part Number: ERJ-3EKF3740V; RoHS: RoHS Compliant; Category: Resistors; Stock 1: 48031; Pricing 1: 1=0.1, 50=0.0114, 100=0.0084, 250=0.00644, 500=0.00514, 1000=0.00379 (USD); Packaging: Cut Tape (CT); Part Status: Active; Tolerance: ±1%; Composition: Thick Film; Features: Automotive AEC-Q200; Operating Temperature: -55°C ~ 155°C; Package / Case: 0603 (1608 Metric); Supplier Device Package: 0603; Size / Dimension: 0.063" L x 0.031" W (1.60mm x 0.80mm); Height: 0.022" (0.55mm); Number of Terminations: 2; ComponentLink1URL: http://industrial.panasonic.com/www-cgi/jvcr13pz.cgi?E+PZ+3+AOA0002+ERJ3EKF3740V+7+WW; ComponentLink1Description: http://industrial.panasonic.com/www-cgi/jvcr13pz.cgi?E+PZ+3+AOA0002+ERJ3EKF3740V+7+WW; Supplier Part Number 1: P374HCT-ND; Load Status: *
U2 = ADP3303ARZ-3.3-RL7: Linear Voltage Regulator IC Positive Fixed 1 Output 3.3V 200mA 8-SOIC; Manufacturer: Analog Devices Inc.; Voltage - Dropout (Typical): 0.18V @ 200mA; Number of Regulators: 1; Voltage - Input: Up to 12V; Supplier 1: Digi-Key; RoHS: RoHS Compliant; Category: Integrated Circuits (ICs); Stock 1: 2012; Pricing 1: 1=3.19, 10=2.867, 100=2.3517, 500=2.0007 (USD); Packaging: Cut Tape (CT); Part Status: Active; Regulator Topology: Positive Fixed; Voltage - Output: 3.3V; Current - Output: 200mA; Current - Limit (Min): -; Operating Temperature: -25°C ~ 125°C; Mounting Type: Surface Mount; Package / Case: 8-SOIC (0.154", 3.90mm Width); Supplier Device Package: 8-SOIC; ComponentLink1URL: http://www.analog.com/media/en/technical-documentation/data-sheets/ADP3303.pdf; ComponentLink1Description: http://www.analog.com/media/en/technical-documentation/data-sheets/ADP3303.pdf; Supplier Part Number 1: ADP3303ARZ-3.3-RL7CT-ND; Manufacturer Part Number: ADP3303ARZ-3.3-RL7
U3 = LTC1983ES6-5#TRMPBF: IC REG SWITCHD CAP INV -5V SOT23; Manufacturer: Linear Technology; Output Type: Fixed; Number of Outputs: 1; Voltage - Input: 2.3 V ~ 5.5 V; PWM Type: Burst Mode®; Frequency - Switching: 900kHz; Current - Output: 100mA; Synchronous Rectifier: No; Supplier 1: Digi-Key; RoHS: RoHS Compliant; Category: Integrated Circuits (ICs); Stock 1: 6466; Pricing 1: 1=4.28, 25=3.8192, 100=3.4371 (USD); Packaging: Cut Tape (CT); Type: Switched Capacitor (Charge Pump), Inverting; Voltage - Output: -5V; Operating Temperature: -40°C ~ 85°C; Mounting Type: Surface Mount; Package / Case: SOT-23-6 Thin, TSOT-23-6; Supplier Device Package: TSOT-23-6; ComponentLink1URL: http://www.linear.com/docs/2135; ComponentLink1Description: http://www.linear.com/docs/2135; Supplier Part Number 1: LTC1983ES6-5#TRMPBFCT-ND; Manufacturer Part Number: LTC1983ES6-5#TRMPBF; Load Status: *